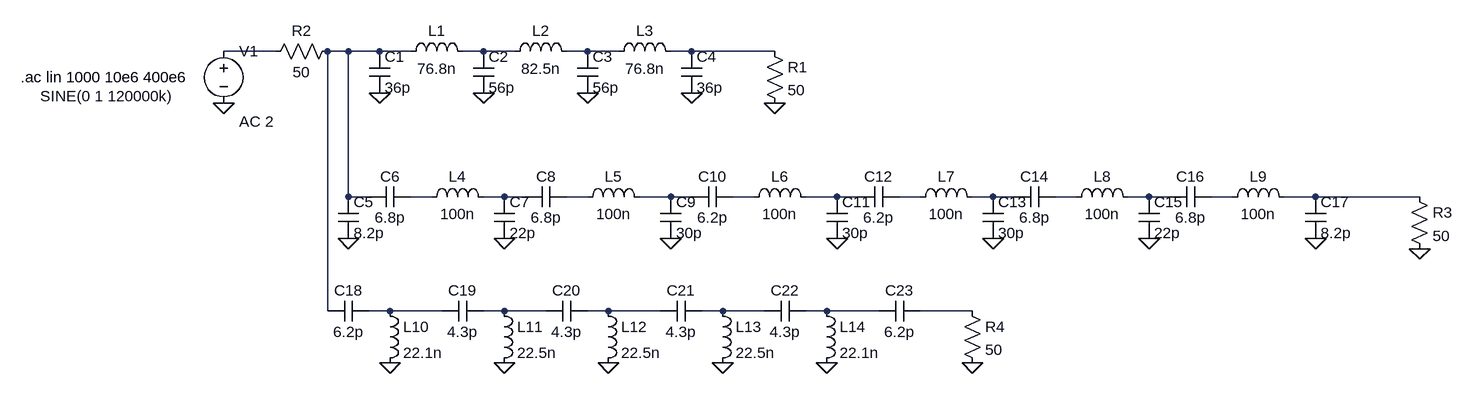
[diagram p0: schematic RF_lumped_element_triplexer.asc]
RF_lumped_element_triplexer.asc, the LTspice schematic file:
Version 4
SHEET 1 1736 680
WIRE -80 96 -160 96
WIRE 32 96 0 96
WIRE 80 96 32 96
WIRE 128 96 80 96
WIRE 240 96 208 96
WIRE 288 96 240 96
WIRE 400 96 368 96
WIRE 448 96 400 96
WIRE 560 96 528 96
WIRE 688 96 560 96
WIRE 32 320 32 96
WIRE 64 320 32 320
WIRE 160 320 128 320
WIRE 272 320 240 320
WIRE 304 320 272 320
WIRE 400 320 368 320
WIRE 528 320 480 320
WIRE 560 320 528 320
WIRE 656 320 624 320
WIRE 784 320 736 320
WIRE 816 320 784 320
WIRE 912 320 880 320
WIRE 1024 320 992 320
WIRE 1056 320 1024 320
WIRE 1152 320 1120 320
WIRE 1264 320 1232 320
WIRE 1296 320 1264 320
WIRE 1392 320 1360 320
WIRE 1520 320 1472 320
WIRE 1680 320 1520 320
WIRE 0 496 0 96
WIRE 96 496 64 496
WIRE 176 496 96 496
WIRE 272 496 240 496
WIRE 336 496 272 496
WIRE 432 496 400 496
WIRE 512 496 432 496
WIRE 608 496 576 496
WIRE 672 496 608 496
WIRE 768 496 736 496
WIRE 848 496 768 496
WIRE 992 496 912 496
FLAG 688 176 0
FLAG 560 160 0
FLAG 400 160 0
FLAG 240 160 0
FLAG 80 160 0
FLAG -160 176 0
FLAG 272 384 0
FLAG 32 384 0
FLAG 528 384 0
FLAG 784 384 0
FLAG 1024 384 0
FLAG 1264 384 0
FLAG 1520 384 0
FLAG 1680 400 0
FLAG 96 576 0
FLAG 272 576 0
FLAG 432 576 0
FLAG 608 576 0
FLAG 768 576 0
FLAG 992 576 0
SYMBOL cap 64 96 R0
SYMATTR InstName C1
SYMATTR Value 36p
SYMBOL ind 112 112 R270
WINDOW 0 32 56 VTop 2
WINDOW 3 5 56 VBottom 2
SYMATTR InstName L1
SYMATTR Value 76.8n
SYMBOL cap 224 96 R0
SYMATTR InstName C2
SYMATTR Value 56p
SYMBOL cap 384 96 R0
SYMATTR InstName C3
SYMATTR Value 56p
SYMBOL cap 544 96 R0
SYMATTR InstName C4
SYMATTR Value 36p
SYMBOL ind 272 112 R270
WINDOW 0 32 56 VTop 2
WINDOW 3 5 56 VBottom 2
SYMATTR InstName L2
SYMATTR Value 82.5n
SYMBOL ind 432 112 R270
WINDOW 0 32 56 VTop 2
WINDOW 3 5 56 VBottom 2
SYMATTR InstName L3
SYMATTR Value 76.8n
SYMBOL res 672 80 R0
SYMATTR InstName R1
SYMATTR Value 50
SYMBOL voltage -160 80 R0
WINDOW 123 24 124 Left 2
WINDOW 39 0 0 Left 0
WINDOW 3 -282 85 Left 2
SYMATTR Value2 AC 2
SYMATTR Value SINE(0 1 120000k)
SYMATTR InstName V1
SYMBOL res 16 80 R90
WINDOW 0 0 56 VBottom 2
WINDOW 3 32 56 VTop 2
SYMATTR InstName R2
SYMATTR Value 50
SYMBOL ind 144 336 R270
WINDOW 0 32 56 VTop 2
WINDOW 3 5 56 VBottom 2
SYMATTR InstName L4
SYMATTR Value 100n
SYMBOL cap 16 320 R0
SYMATTR InstName C5
SYMATTR Value 8.2p
SYMBOL cap 128 304 R90
WINDOW 0 0 32 VBottom 2
WINDOW 3 32 32 VTop 2
SYMATTR InstName C6
SYMATTR Value 6.8p
SYMBOL ind 384 336 R270
WINDOW 0 32 56 VTop 2
WINDOW 3 5 56 VBottom 2
SYMATTR InstName L5
SYMATTR Value 100n
SYMBOL cap 256 320 R0
SYMATTR InstName C7
SYMATTR Value 22p
SYMBOL cap 368 304 R90
WINDOW 0 0 32 VBottom 2
WINDOW 3 32 32 VTop 2
SYMATTR InstName C8
SYMATTR Value 6.8p
SYMBOL ind 640 336 R270
WINDOW 0 32 56 VTop 2
WINDOW 3 5 56 VBottom 2
SYMATTR InstName L6
SYMATTR Value 100n
SYMBOL cap 512 320 R0
SYMATTR InstName C9
SYMATTR Value 30p
SYMBOL cap 624 304 R90
WINDOW 0 0 32 VBottom 2
WINDOW 3 32 32 VTop 2
SYMATTR InstName C10
SYMATTR Value 6.2p
SYMBOL ind 896 336 R270
WINDOW 0 32 56 VTop 2
WINDOW 3 5 56 VBottom 2
SYMATTR InstName L7
SYMATTR Value 100n
SYMBOL cap 768 320 R0
SYMATTR InstName C11
SYMATTR Value 30p
SYMBOL cap 880 304 R90
WINDOW 0 0 32 VBottom 2
WINDOW 3 32 32 VTop 2
SYMATTR InstName C12
SYMATTR Value 6.2p
SYMBOL ind 1136 336 R270
WINDOW 0 32 56 VTop 2
WINDOW 3 5 56 VBottom 2
SYMATTR InstName L8
SYMATTR Value 100n
SYMBOL cap 1008 320 R0
SYMATTR InstName C13
SYMATTR Value 30p
SYMBOL cap 1120 304 R90
WINDOW 0 0 32 VBottom 2
WINDOW 3 32 32 VTop 2
SYMATTR InstName C14
SYMATTR Value 6.8p
SYMBOL ind 1376 336 R270
WINDOW 0 32 56 VTop 2
WINDOW 3 5 56 VBottom 2
SYMATTR InstName L9
SYMATTR Value 100n
SYMBOL cap 1248 320 R0
SYMATTR InstName C15
SYMATTR Value 22p
SYMBOL cap 1360 304 R90
WINDOW 0 0 32 VBottom 2
WINDOW 3 32 32 VTop 2
SYMATTR InstName C16
SYMATTR Value 6.8p
SYMBOL cap 1504 320 R0
SYMATTR InstName C17
SYMATTR Value 8.2p
SYMBOL res 1664 304 R0
SYMATTR InstName R3
SYMATTR Value 50
SYMBOL cap 64 480 R90
WINDOW 0 0 32 VBottom 2
WINDOW 3 32 32 VTop 2
SYMATTR InstName C18
SYMATTR Value 6.2p
SYMBOL ind 80 480 R0
SYMATTR InstName L10
SYMATTR Value 22.1n
SYMBOL cap 240 480 R90
WINDOW 0 0 32 VBottom 2
WINDOW 3 32 32 VTop 2
SYMATTR InstName C19
SYMATTR Value 4.3p
SYMBOL ind 256 480 R0
SYMATTR InstName L11
SYMATTR Value 22.5n
SYMBOL cap 400 480 R90
WINDOW 0 0 32 VBottom 2
WINDOW 3 32 32 VTop 2
SYMATTR InstName C20
SYMATTR Value 4.3p
SYMBOL ind 416 480 R0
SYMATTR InstName L12
SYMATTR Value 22.5n
SYMBOL cap 576 480 R90
WINDOW 0 0 32 VBottom 2
WINDOW 3 32 32 VTop 2
SYMATTR InstName C21
SYMATTR Value 4.3p
SYMBOL ind 592 480 R0
SYMATTR InstName L13
SYMATTR Value 22.5n
SYMBOL cap 736 480 R90
WINDOW 0 0 32 VBottom 2
WINDOW 3 32 32 VTop 2
SYMATTR InstName C22
SYMATTR Value 4.3p
SYMBOL ind 752 480 R0
SYMATTR InstName L14
SYMATTR Value 22.1n
SYMBOL cap 912 480 R90
WINDOW 0 0 32 VBottom 2
WINDOW 3 32 32 VTop 2
SYMATTR InstName C23
SYMATTR Value 6.2p
SYMBOL res 976 480 R0
SYMATTR InstName R4
SYMATTR Value 50
TEXT -472 136 Left 2 !.ac lin 1000 10e6 400e6

The netlist it stands for:
* RF_lumped_element_triplexer.asc
C1 N002 0 36p
L1 N002 N003 76.8n
C2 N003 0 56p
C3 N004 0 56p
C4 N005 0 36p
L2 N003 N004 82.5n
L3 N004 N005 76.8n
R1 N005 0 50
V1 N001 0 SINE(0 1 120000k) AC 2
R2 N002 N001 50
L4 N006 N007 100n
C5 N002 0 8.2p
C6 N006 N002 6.8p
L5 N008 N009 100n
C7 N007 0 22p
C8 N008 N007 6.8p
L6 N010 N011 100n
C9 N009 0 30p
C10 N010 N009 6.2p
L7 N012 N013 100n
C11 N011 0 30p
C12 N012 N011 6.2p
L8 N014 N015 100n
C13 N013 0 30p
C14 N014 N013 6.8p
L9 N016 N017 100n
C15 N015 0 22p
C16 N016 N015 6.8p
C17 N017 0 8.2p
R3 N017 0 50
C18 N018 N002 6.2p
L10 N018 0 22.1n
C19 N019 N018 4.3p
L11 N019 0 22.5n
C20 N020 N019 4.3p
L12 N020 0 22.5n
C21 N021 N020 4.3p
L13 N021 0 22.5n
C22 N022 N021 4.3p
L14 N022 0 22.1n
C23 N023 N022 6.2p
R4 N023 0 50
.ac lin 1000 10e6 400e6
.backanno
.end